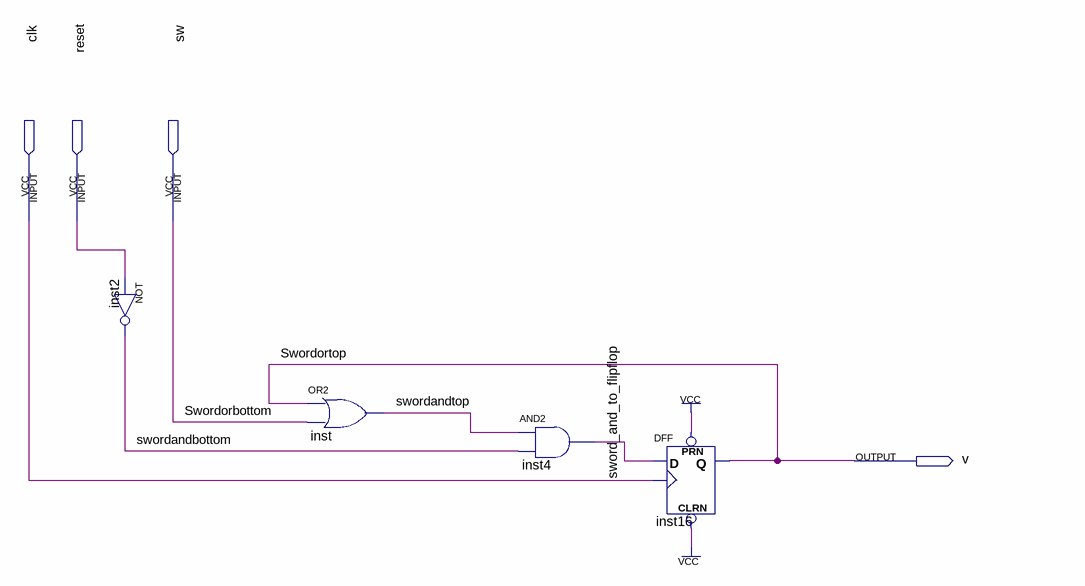
[diagram p0: schematic sheet]
// Quartus schematic sword.bdf as structural Verilog: 4 symbols, 4 pins
module sword (
  input  clk,
  input  reset,
  input  sw,
  output v
);

  wire sword_and_to_flipflop, swordandbottom, swordandtop;

  not inst2 (swordandbottom, reset);
  or inst (swordandtop, v, sw);
  and inst4 (sword_and_to_flipflop, swordandtop, swordandbottom);
  DFF inst16 (.CLRN(1'b1), .CLK(clk), .D(sword_and_to_flipflop), .PRN(1'b1), .Q(v));

  // Other names for the same wires on the sheet: Swordorbottom = sw; Swordortop = v
endmodule
